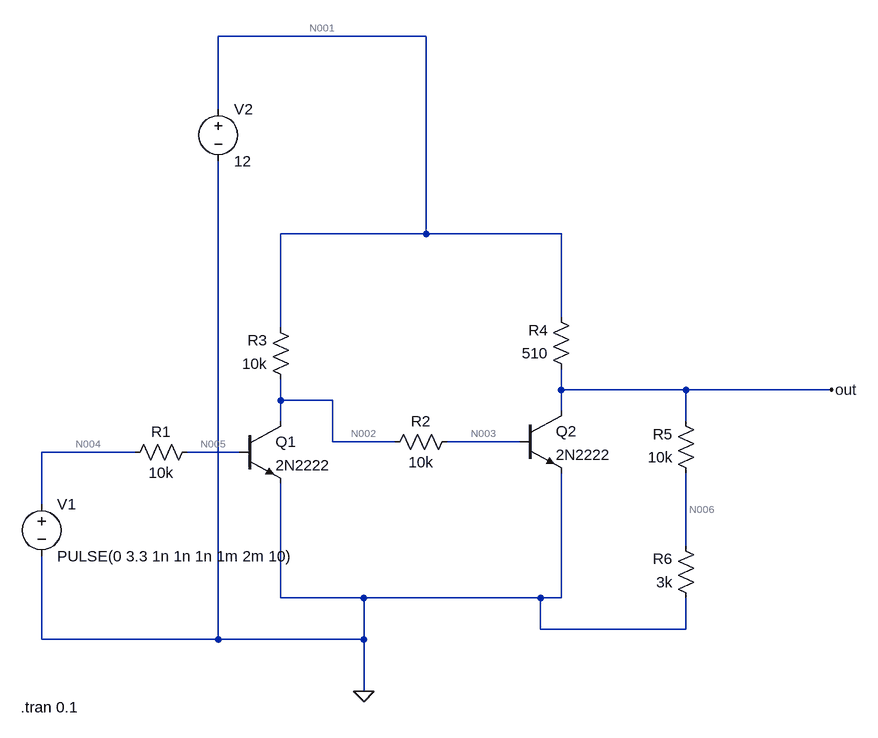
[diagram p0: schematic Draft1.asc]
Draft1.asc, the LTspice schematic file:
Version 4
SHEET 1 1000 680
WIRE 320 -400 0 -400
WIRE 0 -288 0 -400
WIRE 320 -96 320 -400
WIRE 320 -96 96 -96
WIRE 528 -96 320 -96
WIRE 528 32 528 -96
WIRE 96 48 96 -96
WIRE 528 144 528 112
WIRE 720 144 528 144
WIRE 944 144 720 144
WIRE 96 160 96 128
WIRE 176 160 96 160
WIRE 528 176 528 144
WIRE 96 192 96 160
WIRE 720 192 720 144
WIRE 176 224 176 160
WIRE 272 224 176 224
WIRE 464 224 352 224
WIRE -128 240 -272 240
WIRE 32 240 -48 240
WIRE -272 320 -272 240
WIRE 720 384 720 272
WIRE 96 464 96 288
WIRE 224 464 96 464
WIRE 496 464 224 464
WIRE 528 464 528 272
WIRE 528 464 496 464
WIRE 496 512 496 464
WIRE 720 512 720 464
WIRE 720 512 496 512
WIRE -272 528 -272 400
WIRE 0 528 0 -208
WIRE 0 528 -272 528
WIRE 224 528 224 464
WIRE 224 528 0 528
WIRE 224 608 224 528
FLAG 224 608 0
FLAG 944 144 out
SYMBOL npn 32 192 R0
SYMATTR InstName Q1
SYMATTR Value 2N2222
SYMBOL npn 464 176 R0
SYMATTR InstName Q2
SYMATTR Value 2N2222
SYMBOL res -32 224 R90
WINDOW 0 0 56 VBottom 2
WINDOW 3 32 56 VTop 2
SYMATTR InstName R1
SYMATTR Value 10k
SYMBOL res 368 208 R90
WINDOW 0 0 56 VBottom 2
WINDOW 3 32 56 VTop 2
SYMATTR InstName R2
SYMATTR Value 10k
SYMBOL res 112 144 R180
WINDOW 0 36 76 Left 2
WINDOW 3 36 40 Left 2
SYMATTR InstName R3
SYMATTR Value 10k
SYMBOL res 544 128 R180
WINDOW 0 36 76 Left 2
WINDOW 3 36 40 Left 2
SYMATTR InstName R4
SYMATTR Value 510
SYMBOL res 736 288 R180
WINDOW 0 36 76 Left 2
WINDOW 3 36 40 Left 2
SYMATTR InstName R5
SYMATTR Value 10k
SYMBOL res 736 480 R180
WINDOW 0 36 76 Left 2
WINDOW 3 36 40 Left 2
SYMATTR InstName R6
SYMATTR Value 3k
SYMBOL voltage -272 304 R0
WINDOW 123 0 0 Left 0
WINDOW 39 0 0 Left 0
SYMATTR InstName V1
SYMATTR Value PULSE(0 3.3 1n 1n 1n 1m 2m 10)
SYMBOL voltage 0 -304 R0
WINDOW 123 0 0 Left 0
WINDOW 39 0 0 Left 0
SYMATTR InstName V2
SYMATTR Value 12
TEXT -304 632 Left 2 !.tran 0.1

The netlist it stands for:
* Draft1.asc
Q1 N002 N005 0 0 2N2222
Q2 out N003 0 0 2N2222
R1 N005 N004 10k
R2 N003 N002 10k
R3 N002 N001 10k
R4 out N001 510
R5 N006 out 10k
R6 0 N006 3k
V1 N004 0 PULSE(0 3.3 1n 1n 1n 1m 2m 10)
V2 N001 0 12
.model NPN NPN
.model PNP PNP
.lib standard.bjt
.tran 0.1
.backanno
.end

* Results of the author's LTspice run, read from the files saved beside the schematic
* Operating Point, zero values left out:
*   V(n002) = 6.375 V
*   V(n005) = 63.79 nV
*   V(out) = 90.86 mV
*   V(n003) = 751 mV
*   V(n001) = 12 V
*   V(n006) = 20.97 mV
*   Ic(Q1) = 6.389 pA
*   Ib(Q1) = -6.379 pA
*   Ic(Q2) = 23.34 mA
*   Ib(Q2) = 562.5 µA
*   Ie(Q2) = -23.91 mA
*   I(R1) = 6.379 pA
*   I(R2) = -562.5 µA
*   I(R3) = -562.5 µA
*   I(R4) = -23.35 mA
*   I(R5) = -6.99 µA
*   I(R6) = -6.99 µA
*   I(V1) = 6.379 pA
*   I(V2) = -23.91 mA
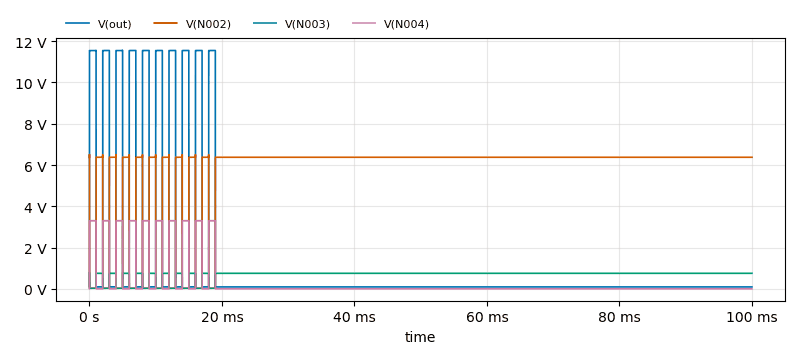
[diagram p1: Transient Analysis of Draft1.asc, plotted from the saved traces]
* Transient Analysis, 1 run:
*   V(out): min 90.79 mV, max 11.56 V, average 1.237 V, rms 3.652 V, last 90.86 mV
*   V(N002): min 24.78 mV, max 6.513 V, average 5.74 V, rms 6.048 V, last 6.375 V
*   V(N003): min 28.18 mV, max 751.1 mV, average 678.8 mV, rms 712.5 mV, last 751 mV
*   V(N004): min 0 V, max 3.3 V, average 330 mV, rms 1.044 V, last 0 V